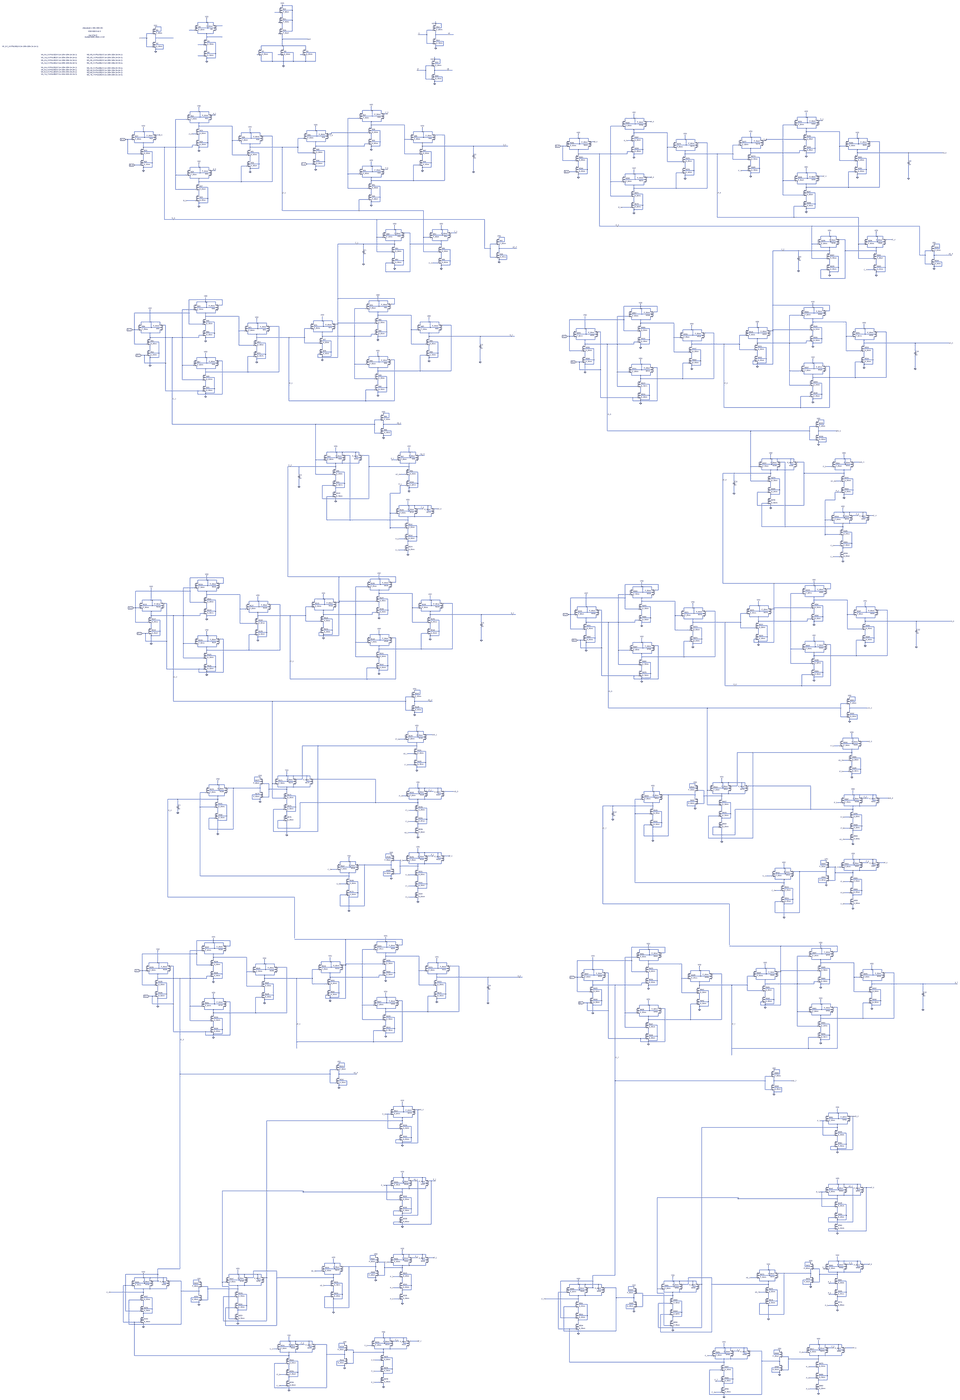
[diagram p0: schematic cla_transistor_level_schematic.asc, whole sheet]
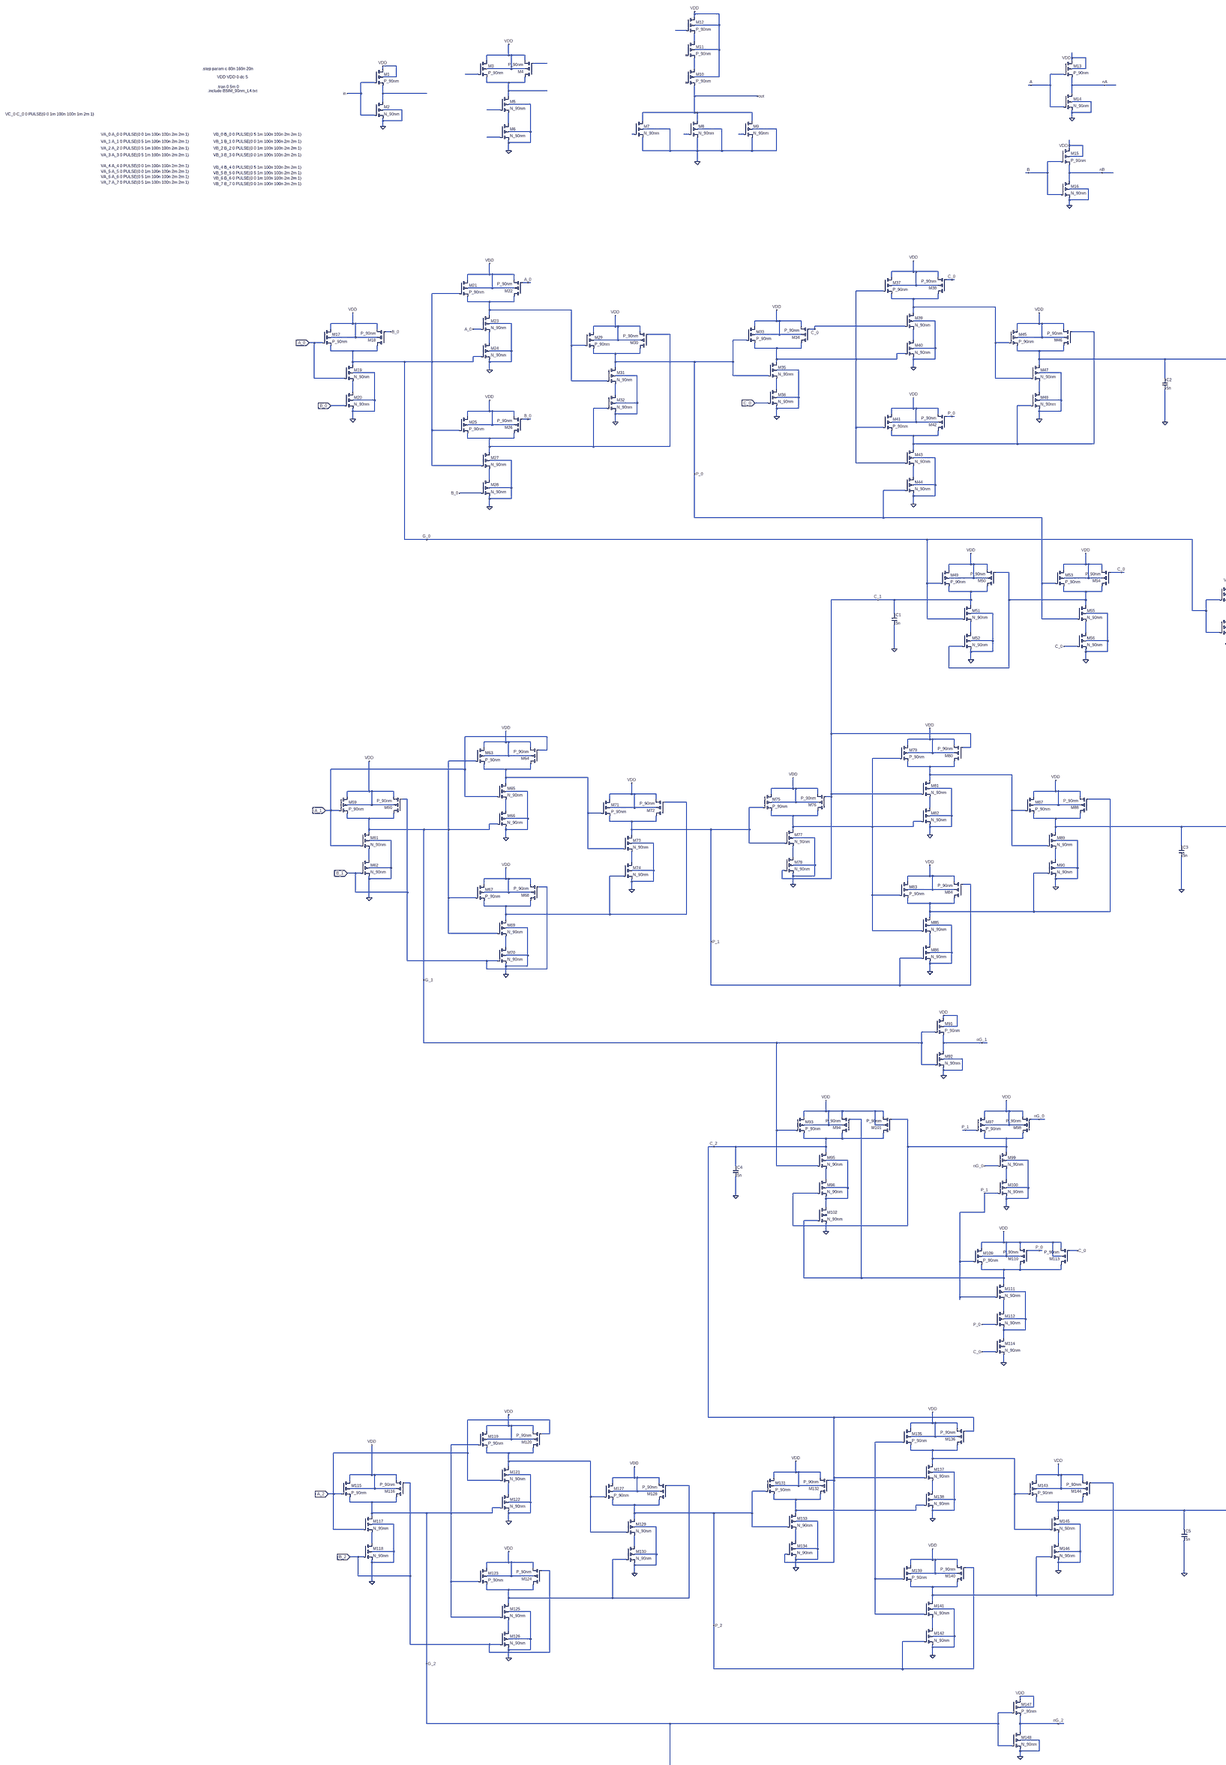
[diagram p1: schematic cla_transistor_level_schematic.asc, part, row 1 of 2, column 1 of 2]
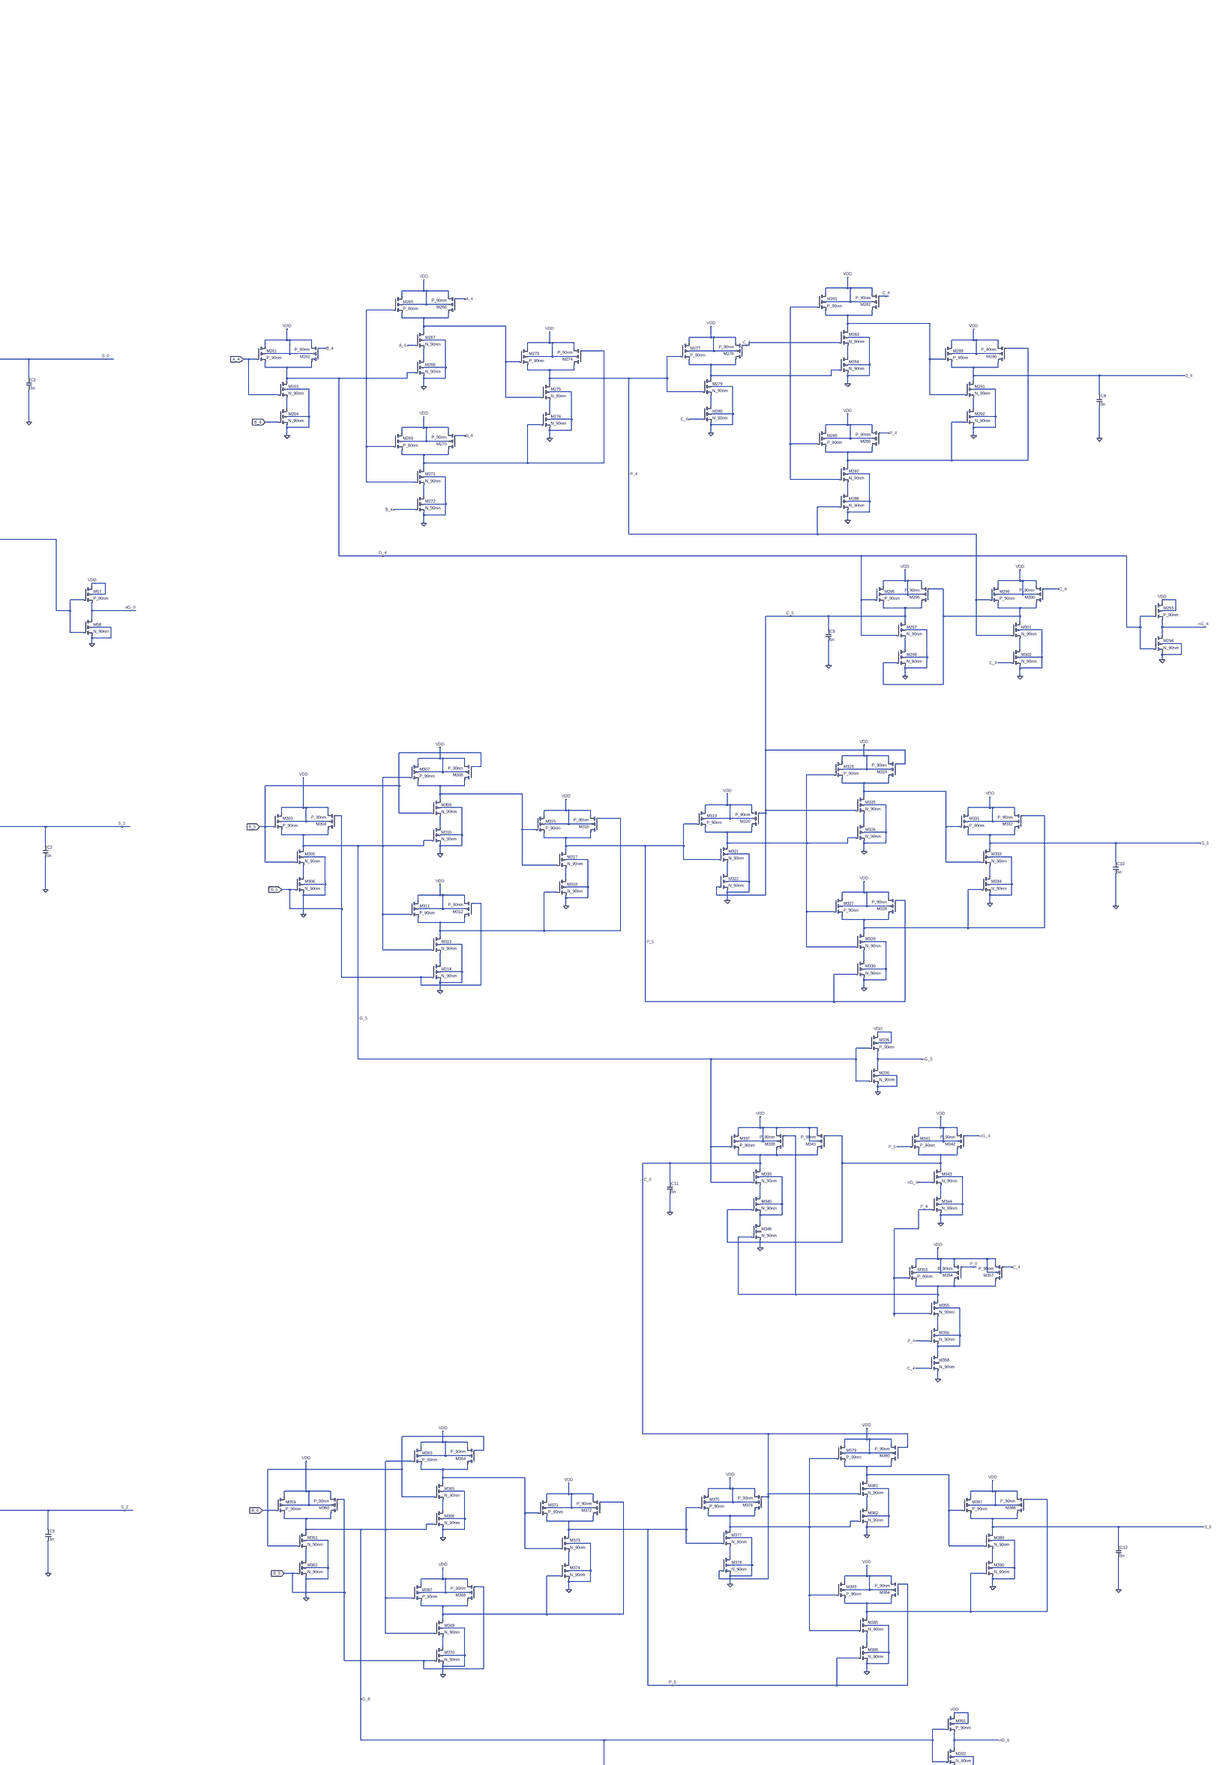
[diagram p2: schematic cla_transistor_level_schematic.asc, part, row 1 of 2, column 2 of 2]
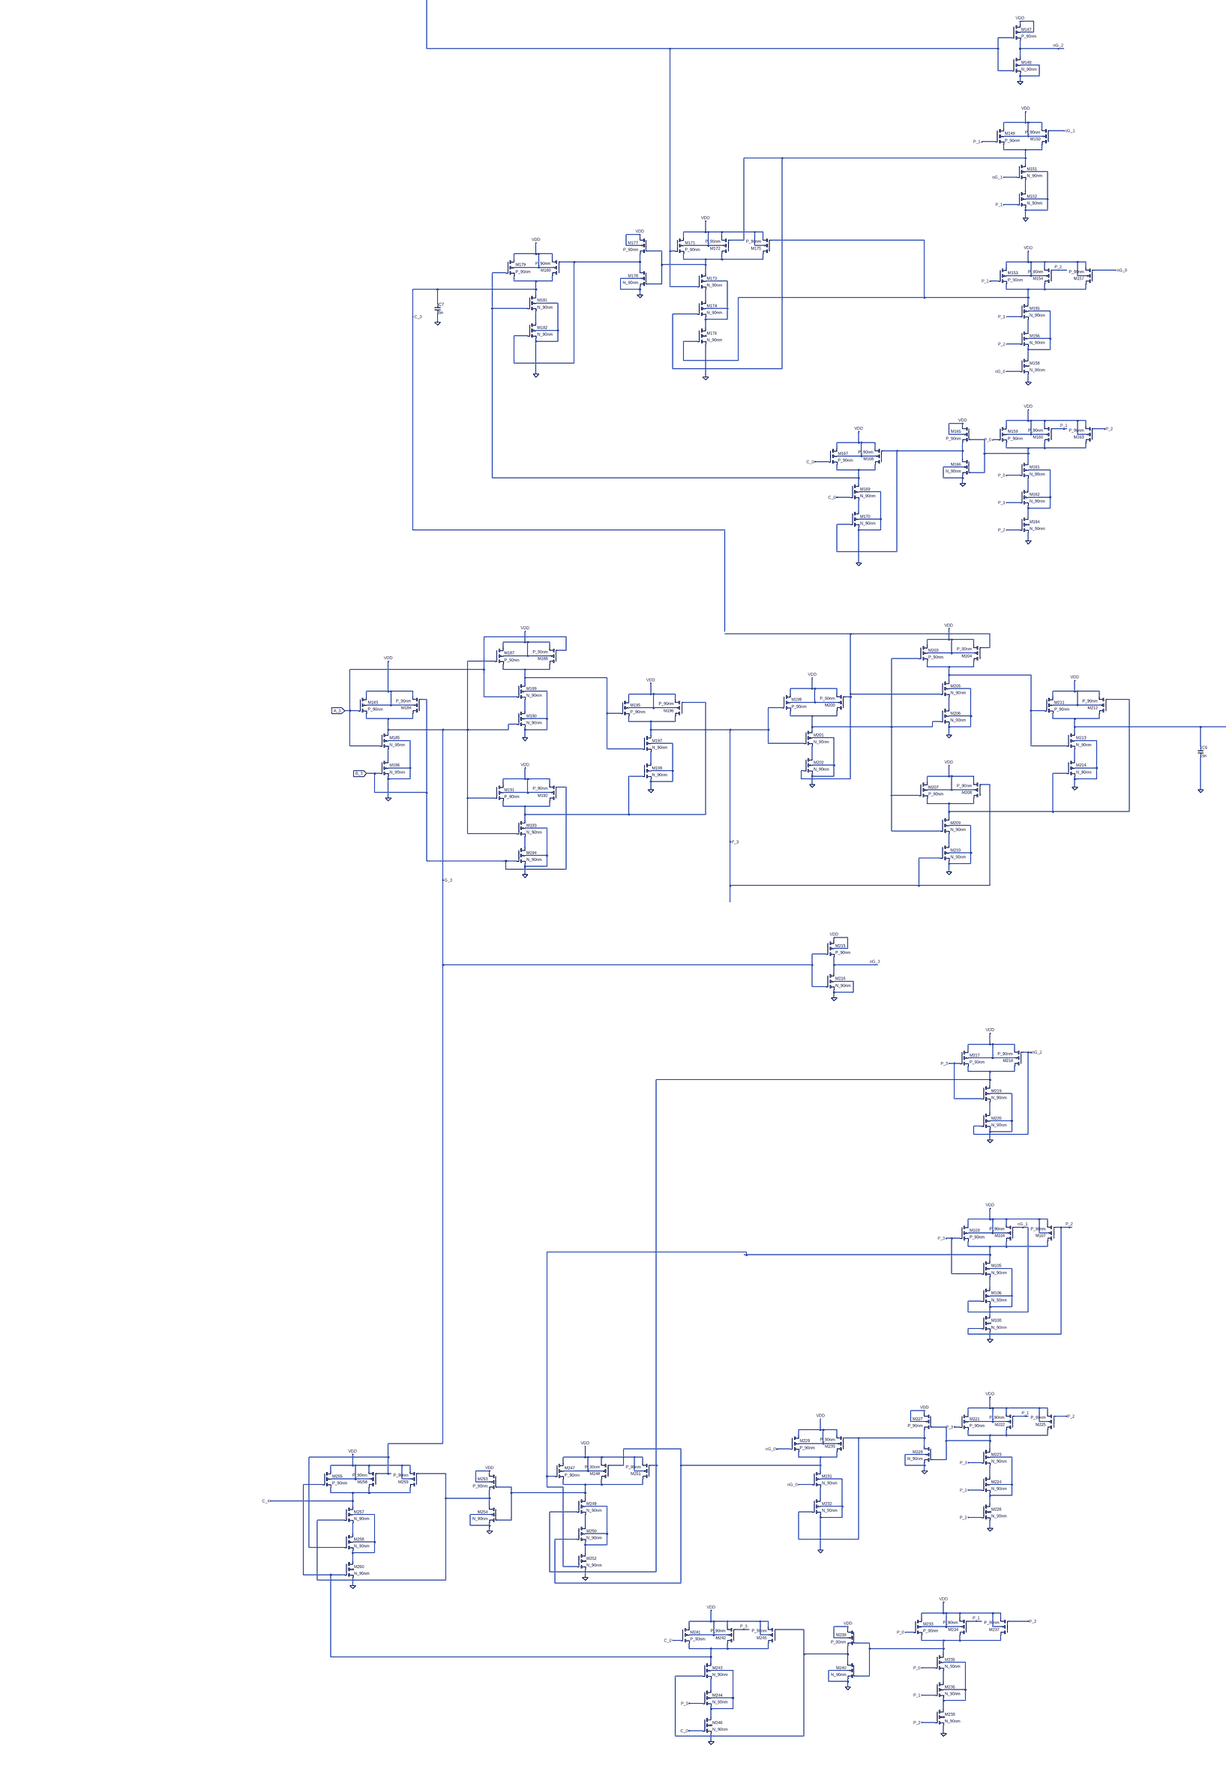
[diagram p3: schematic cla_transistor_level_schematic.asc, part, row 2 of 2, column 1 of 2]
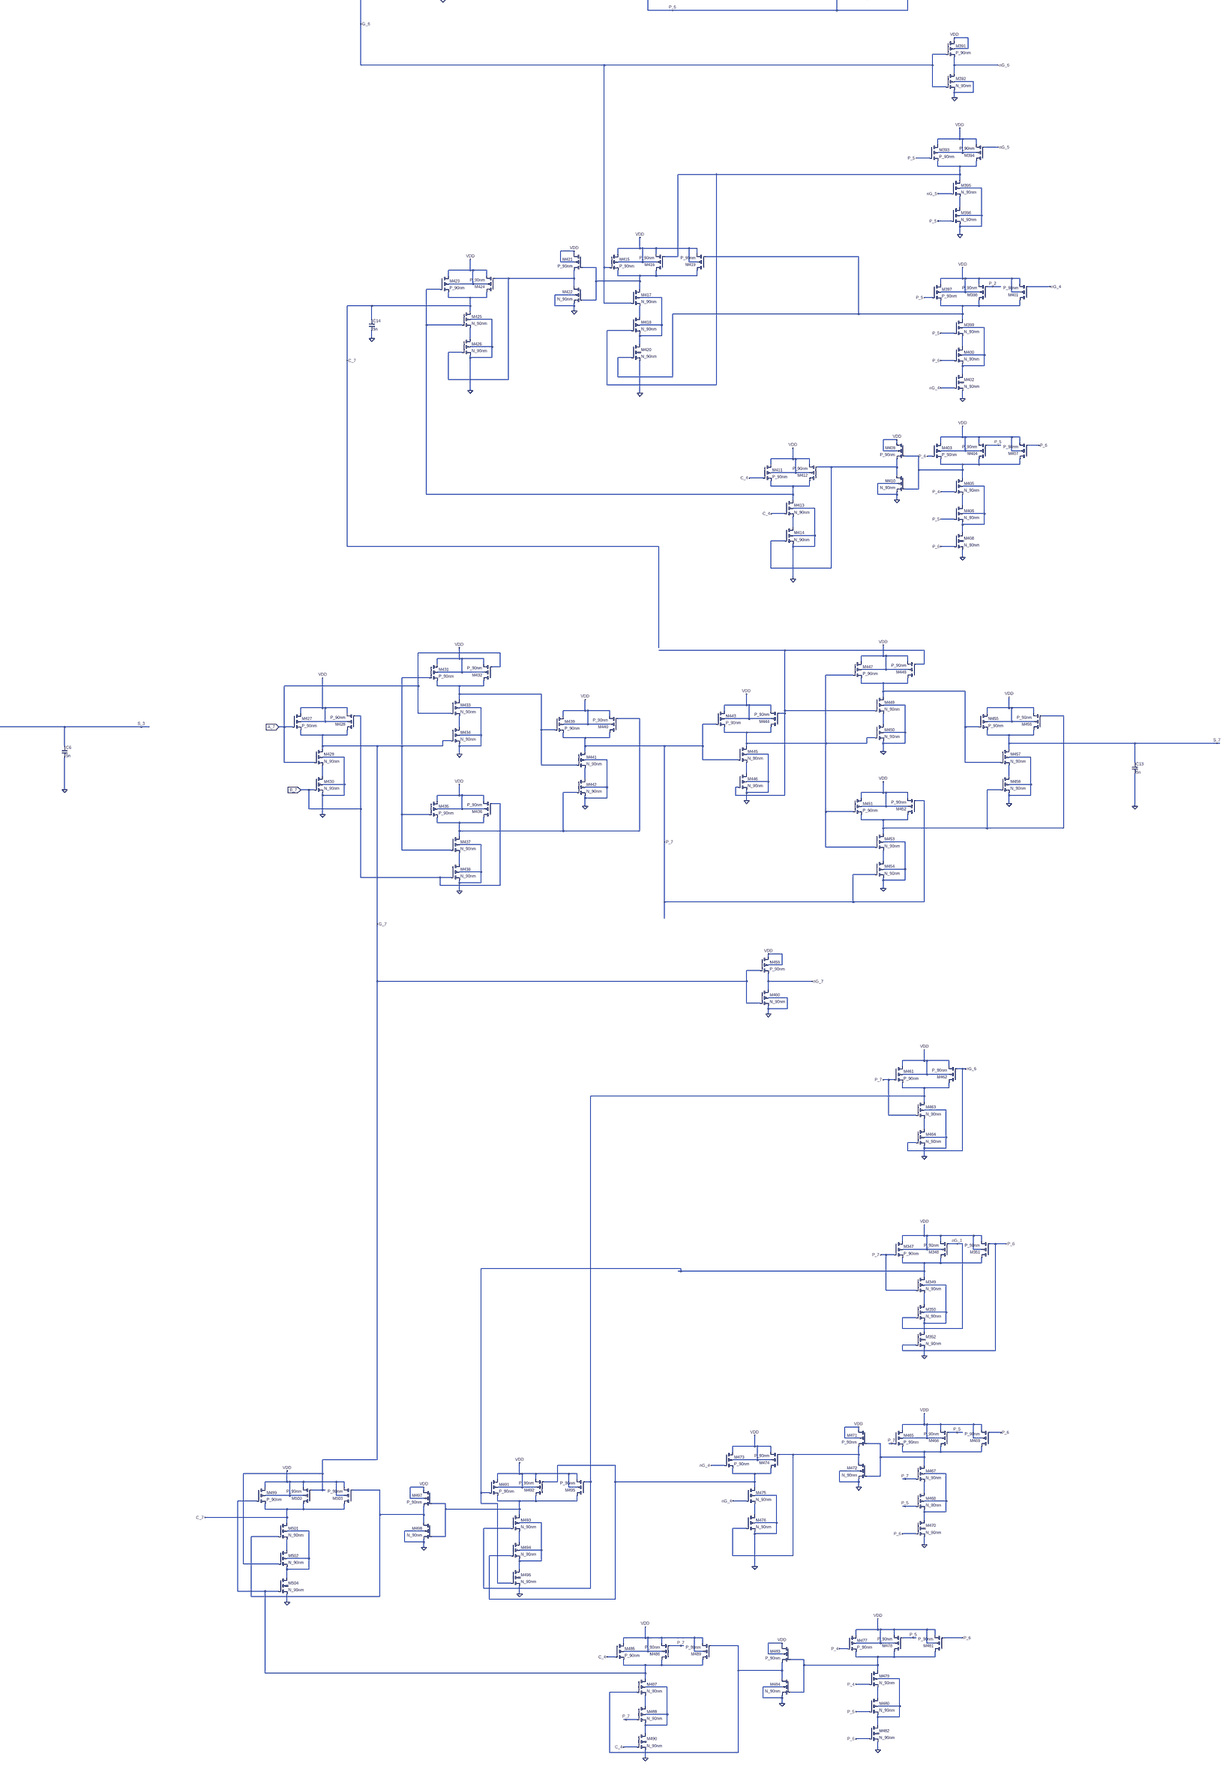
[diagram p4: schematic cla_transistor_level_schematic.asc, part, row 2 of 2, column 2 of 2]
* cla_transistor_level_schematic.asc
M1 VDD in N007 VDD P_90nm l=90n w=1800nm
M2 N007 in 0 0 N_90nm l=90n w=1800nm
M3 VDD N005 N006 VDD P_90nm l=90n w=1800n
M4 N006 N003 VDD VDD P_90nm l=90n w=1800n
M5 N006 N008 N009 0 N_90nm l=90n w=450n
M6 N009 N013 0 0 N_90nm l=90n w=450n
M7 out N010 0 0 N_90nm l=90n w=900n
M8 out N011 0 0 N_90nm l=90n w=900n
M9 out N012 0 0 N_90nm l=90n w=900n
M10 N004 NC_01 out VDD P_90nm l=90n w=600n
M11 N002 NC_02 N004 VDD P_90nm l=90n w=600n
M12 VDD N001 N002 VDD P_90nm l=90n w=600n
M13 VDD A nA VDD P_90nm l=90n w=1800nm
M14 nA A 0 0 N_90nm l=90n w=1800nm
M15 VDD B nB VDD P_90nm l=90n w=1800nm
M16 nB B 0 0 N_90nm l=90n w=1800nm
M17 VDD A_0 G_0 VDD P_90nm l=90n w=1800n
M18 G_0 B_0 VDD VDD P_90nm l=90n w=1800n
M19 G_0 A_0 N029 0 N_90nm l=90n w=450n
M20 N029 B_0 0 0 N_90nm l=90n w=450n
M21 VDD G_0 N016 VDD P_90nm l=90n w=1800n
M22 N016 A_0 VDD VDD P_90nm l=90n w=1800n
M23 N016 A_0 N023 0 N_90nm l=90n w=450n
M24 N023 G_0 0 0 N_90nm l=90n w=450n
M25 VDD G_0 N021 VDD P_90nm l=90n w=1800n
M26 N021 B_0 VDD VDD P_90nm l=90n w=1800n
M27 N021 G_0 N037 0 N_90nm l=90n w=450n
M28 N037 B_0 0 0 N_90nm l=90n w=450n
M29 VDD N016 P_0 VDD P_90nm l=90n w=1800n
M30 P_0 N021 VDD VDD P_90nm l=90n w=1800n
M31 P_0 N016 N031 0 N_90nm l=90n w=450n
M32 N031 N021 0 0 N_90nm l=90n w=450n
M33 VDD P_0 N014 VDD P_90nm l=90n w=1800n
M34 N014 C_0 VDD VDD P_90nm l=90n w=1800n
M35 N014 P_0 N028 0 N_90nm l=90n w=450n
M36 N028 C_0 0 0 N_90nm l=90n w=450n
M37 VDD N014 N015 VDD P_90nm l=90n w=1800n
M38 N015 C_0 VDD VDD P_90nm l=90n w=1800n
M39 N015 C_0 N022 0 N_90nm l=90n w=450n
M40 N022 N014 0 0 N_90nm l=90n w=450n
M41 VDD N014 N020 VDD P_90nm l=90n w=1800n
M42 N020 P_0 VDD VDD P_90nm l=90n w=1800n
M43 N020 N014 N036 0 N_90nm l=90n w=450n
M44 N036 P_0 0 0 N_90nm l=90n w=450n
M45 VDD N015 S_0 VDD P_90nm l=90n w=1800n
M46 S_0 N020 VDD VDD P_90nm l=90n w=1800n
M47 S_0 N015 N030 0 N_90nm l=90n w=450n
M48 N030 N020 0 0 N_90nm l=90n w=450n
C2 S_0 0 5n
M57 VDD G_0 nG_0 VDD P_90nm l=90n w=1800nm
M58 nG_0 G_0 0 0 N_90nm l=90n w=1800nm
M49 VDD G_0 C_1 VDD P_90nm l=90n w=1800n
M50 C_1 N040 VDD VDD P_90nm l=90n w=1800n
M51 C_1 G_0 N042 0 N_90nm l=90n w=450n
M52 N042 N040 0 0 N_90nm l=90n w=450n
M53 VDD P_0 N040 VDD P_90nm l=90n w=1800n
M54 N040 C_0 VDD VDD P_90nm l=90n w=1800n
M55 N040 P_0 N043 0 N_90nm l=90n w=450n
M56 N043 C_0 0 0 N_90nm l=90n w=450n
C1 C_1 0 5n
M59 VDD A_1 G_1 VDD P_90nm l=90n w=1800n
M60 G_1 B_1 VDD VDD P_90nm l=90n w=1800n
M61 G_1 A_1 N061 0 N_90nm l=90n w=450n
M62 N061 B_1 0 0 N_90nm l=90n w=450n
M63 VDD G_1 N048 VDD P_90nm l=90n w=1800n
M64 N048 A_1 VDD VDD P_90nm l=90n w=1800n
M65 N048 A_1 N055 0 N_90nm l=90n w=450n
M66 N055 G_1 0 0 N_90nm l=90n w=450n
M67 VDD G_1 N053 VDD P_90nm l=90n w=1800n
M68 N053 B_1 VDD VDD P_90nm l=90n w=1800n
M69 N053 G_1 N069 0 N_90nm l=90n w=450n
M70 N069 B_1 0 0 N_90nm l=90n w=450n
M71 VDD N048 P_1 VDD P_90nm l=90n w=1800n
M72 P_1 N053 VDD VDD P_90nm l=90n w=1800n
M73 P_1 N048 N063 0 N_90nm l=90n w=450n
M74 N063 N053 0 0 N_90nm l=90n w=450n
M75 VDD P_1 N046 VDD P_90nm l=90n w=1800n
M76 N046 C_1 VDD VDD P_90nm l=90n w=1800n
M77 N046 P_1 N060 0 N_90nm l=90n w=450n
M78 N060 C_1 0 0 N_90nm l=90n w=450n
M79 VDD N046 N047 VDD P_90nm l=90n w=1800n
M80 N047 C_1 VDD VDD P_90nm l=90n w=1800n
M81 N047 C_1 N054 0 N_90nm l=90n w=450n
M82 N054 N046 0 0 N_90nm l=90n w=450n
M83 VDD N046 N052 VDD P_90nm l=90n w=1800n
M84 N052 P_1 VDD VDD P_90nm l=90n w=1800n
M85 N052 N046 N068 0 N_90nm l=90n w=450n
M86 N068 P_1 0 0 N_90nm l=90n w=450n
M87 VDD N047 S_1 VDD P_90nm l=90n w=1800n
M88 S_1 N052 VDD VDD P_90nm l=90n w=1800n
M89 S_1 N047 N062 0 N_90nm l=90n w=450n
M90 N062 N052 0 0 N_90nm l=90n w=450n
C3 S_1 0 5n
M91 VDD G_1 nG_1 VDD P_90nm l=90n w=1800nm
M92 nG_1 G_1 0 0 N_90nm l=90n w=1800nm
M93 VDD G_1 C_2 VDD P_90nm l=90n w=1800n
M94 C_2 N072 VDD VDD P_90nm l=90n w=1800n
M95 C_2 G_1 N078 N076 N_90nm l=90n w=450n
M96 N078 N073 N076 N076 N_90nm l=90n w=450n
M97 VDD P_1 N073 VDD P_90nm l=90n w=1800n
M98 N073 nG_0 VDD VDD P_90nm l=90n w=1800n
M99 N073 nG_0 N079 0 N_90nm l=90n w=450n
M100 N079 P_1 0 0 N_90nm l=90n w=450n
M101 C_2 N073 VDD VDD P_90nm l=90n w=1800n
M102 N076 N072 0 NC_03 N_90nm l=90n w=450n
M103 VDD P_3 N176 VDD P_90nm l=90n w=1800n
M104 N176 nG_1 VDD VDD P_90nm l=90n w=1800n
M105 N176 P_3 N180 N178 N_90nm l=90n w=450n
M106 N180 nG_1 N178 N178 N_90nm l=90n w=450n
M107 N176 P_2 VDD VDD P_90nm l=90n w=1800n
M108 N178 P_2 0 NC_04 N_90nm l=90n w=450n
M109 VDD P_1 N072 VDD P_90nm l=90n w=1800n
M110 N072 P_0 VDD VDD P_90nm l=90n w=1800n
M111 N072 P_1 N084 N082 N_90nm l=90n w=450n
M112 N084 P_0 N082 N082 N_90nm l=90n w=450n
M113 N072 C_0 VDD VDD P_90nm l=90n w=1800n
M114 N082 C_0 0 NC_05 N_90nm l=90n w=450n
C4 C_2 0 5n
M115 VDD A_2 G_2 VDD P_90nm l=90n w=1800n
M116 G_2 B_2 VDD VDD P_90nm l=90n w=1800n
M117 G_2 A_2 N101 0 N_90nm l=90n w=450n
M118 N101 B_2 0 0 N_90nm l=90n w=450n
M119 VDD G_2 N088 VDD P_90nm l=90n w=1800n
M120 N088 A_2 VDD VDD P_90nm l=90n w=1800n
M121 N088 A_2 N095 0 N_90nm l=90n w=450n
M122 N095 G_2 0 0 N_90nm l=90n w=450n
M123 VDD G_2 N093 VDD P_90nm l=90n w=1800n
M124 N093 B_2 VDD VDD P_90nm l=90n w=1800n
M125 N093 G_2 N109 0 N_90nm l=90n w=450n
M126 N109 B_2 0 0 N_90nm l=90n w=450n
M127 VDD N088 P_2 VDD P_90nm l=90n w=1800n
M128 P_2 N093 VDD VDD P_90nm l=90n w=1800n
M129 P_2 N088 N103 0 N_90nm l=90n w=450n
M130 N103 N093 0 0 N_90nm l=90n w=450n
M131 VDD P_2 N086 VDD P_90nm l=90n w=1800n
M132 N086 C_2 VDD VDD P_90nm l=90n w=1800n
M133 N086 P_2 N100 0 N_90nm l=90n w=450n
M134 N100 C_2 0 0 N_90nm l=90n w=450n
M135 VDD N086 N087 VDD P_90nm l=90n w=1800n
M136 N087 C_2 VDD VDD P_90nm l=90n w=1800n
M137 N087 C_2 N094 0 N_90nm l=90n w=450n
M138 N094 N086 0 0 N_90nm l=90n w=450n
M139 VDD N086 N092 VDD P_90nm l=90n w=1800n
M140 N092 P_2 VDD VDD P_90nm l=90n w=1800n
M141 N092 N086 N108 0 N_90nm l=90n w=450n
M142 N108 P_2 0 0 N_90nm l=90n w=450n
M143 VDD N087 S_2 VDD P_90nm l=90n w=1800n
M144 S_2 N092 VDD VDD P_90nm l=90n w=1800n
M145 S_2 N087 N102 0 N_90nm l=90n w=450n
M146 N102 N092 0 0 N_90nm l=90n w=450n
C5 S_2 0 5n
M147 VDD G_2 nG_2 VDD P_90nm l=90n w=1800nm
M148 nG_2 G_2 0 0 N_90nm l=90n w=1800nm
M149 VDD P_1 N112 VDD P_90nm l=90n w=1800n
M150 N112 nG_1 VDD VDD P_90nm l=90n w=1800n
M151 N112 nG_1 N114 0 N_90nm l=90n w=450n
M152 N114 P_1 0 0 N_90nm l=90n w=450n
M153 VDD P_1 N116 VDD P_90nm l=90n w=1800n
M154 N116 P_2 VDD VDD P_90nm l=90n w=1800n
M155 N116 P_1 N131 N127 N_90nm l=90n w=450n
M156 N131 P_2 N127 N127 N_90nm l=90n w=450n
M157 N116 nG_0 VDD VDD P_90nm l=90n w=1800n
M158 N127 nG_0 0 NC_06 N_90nm l=90n w=450n
M159 VDD P_0 N134 VDD P_90nm l=90n w=1800n
M160 N134 P_1 VDD VDD P_90nm l=90n w=1800n
M161 N134 P_0 N140 N138 N_90nm l=90n w=450n
M162 N140 P_1 N138 N138 N_90nm l=90n w=450n
M163 N134 P_2 VDD VDD P_90nm l=90n w=1800n
M164 N138 P_2 0 NC_07 N_90nm l=90n w=450n
M165 VDD N134 N135 VDD P_90nm l=90n w=1800nm
M166 N135 N134 0 0 N_90nm l=90n w=1800nm
M167 VDD C_0 N121 VDD P_90nm l=90n w=1800n
M168 N121 N135 VDD VDD P_90nm l=90n w=1800n
M169 N121 C_0 N142 0 N_90nm l=90n w=450n
M170 N142 N135 0 0 N_90nm l=90n w=450n
M171 VDD G_2 N117 VDD P_90nm l=90n w=1800n
M172 N117 N112 VDD VDD P_90nm l=90n w=1800n
M173 N117 G_2 N126 N123 N_90nm l=90n w=450n
M174 N126 N112 N123 N123 N_90nm l=90n w=450n
M175 N117 N116 VDD VDD P_90nm l=90n w=1800n
M176 N123 N116 0 NC_08 N_90nm l=90n w=450n
M177 VDD N117 N119 VDD P_90nm l=90n w=1800nm
M178 N119 N117 0 0 N_90nm l=90n w=1800nm
M179 VDD N121 C_3 VDD P_90nm l=90n w=1800n
M180 C_3 N119 VDD VDD P_90nm l=90n w=1800n
M181 C_3 N121 N129 0 N_90nm l=90n w=450n
M182 N129 N119 0 0 N_90nm l=90n w=450n
M183 VDD A_3 G_3 VDD P_90nm l=90n w=1800n
M184 G_3 B_3 VDD VDD P_90nm l=90n w=1800n
M185 G_3 A_3 N161 0 N_90nm l=90n w=450n
M186 N161 B_3 0 0 N_90nm l=90n w=450n
M187 VDD G_3 N148 VDD P_90nm l=90n w=1800n
M188 N148 A_3 VDD VDD P_90nm l=90n w=1800n
M189 N148 A_3 N155 0 N_90nm l=90n w=450n
M190 N155 G_3 0 0 N_90nm l=90n w=450n
M191 VDD G_3 N153 VDD P_90nm l=90n w=1800n
M192 N153 B_3 VDD VDD P_90nm l=90n w=1800n
M193 N153 G_3 N169 0 N_90nm l=90n w=450n
M194 N169 B_3 0 0 N_90nm l=90n w=450n
M195 VDD N148 P_3 VDD P_90nm l=90n w=1800n
M196 P_3 N153 VDD VDD P_90nm l=90n w=1800n
M197 P_3 N148 N163 0 N_90nm l=90n w=450n
M198 N163 N153 0 0 N_90nm l=90n w=450n
M199 VDD P_3 N146 VDD P_90nm l=90n w=1800n
M200 N146 N144 VDD VDD P_90nm l=90n w=1800n
M201 N146 P_3 N160 0 N_90nm l=90n w=450n
M202 N160 N144 0 0 N_90nm l=90n w=450n
M203 VDD N146 N147 VDD P_90nm l=90n w=1800n
M204 N147 N144 VDD VDD P_90nm l=90n w=1800n
M205 N147 N144 N154 0 N_90nm l=90n w=450n
M206 N154 N146 0 0 N_90nm l=90n w=450n
M207 VDD N146 N152 VDD P_90nm l=90n w=1800n
M208 N152 P_3 VDD VDD P_90nm l=90n w=1800n
M209 N152 N146 N168 0 N_90nm l=90n w=450n
M210 N168 P_3 0 0 N_90nm l=90n w=450n
M211 VDD N147 S_3 VDD P_90nm l=90n w=1800n
M212 S_3 N152 VDD VDD P_90nm l=90n w=1800n
M213 S_3 N147 N162 0 N_90nm l=90n w=450n
M214 N162 N152 0 0 N_90nm l=90n w=450n
C6 S_3 0 5n
C7 C_3 0 5n
M215 VDD G_3 nG_3 VDD P_90nm l=90n w=1800nm
M216 nG_3 G_3 0 0 N_90nm l=90n w=1800nm
M217 VDD P_3 N172 VDD P_90nm l=90n w=1800n
M218 N172 nG_2 VDD VDD P_90nm l=90n w=1800n
M219 N172 P_3 N174 0 N_90nm l=90n w=450n
M220 N174 nG_2 0 0 N_90nm l=90n w=450n
M221 VDD P_3 N182 VDD P_90nm l=90n w=1800n
M222 N182 P_1 VDD VDD P_90nm l=90n w=1800n
M223 N182 P_3 N191 N187 N_90nm l=90n w=450n
M224 N191 P_1 N187 N187 N_90nm l=90n w=450n
M225 N182 P_2 VDD VDD P_90nm l=90n w=1800n
M226 N187 P_2 0 NC_09 N_90nm l=90n w=450n
M227 VDD N182 N183 VDD P_90nm l=90n w=1800nm
M228 N183 N182 0 0 N_90nm l=90n w=1800nm
M229 VDD nG_0 N185 VDD P_90nm l=90n w=1800n
M230 N185 N183 VDD VDD P_90nm l=90n w=1800n
M231 N185 nG_0 N196 0 N_90nm l=90n w=450n
M232 N196 N183 0 0 N_90nm l=90n w=450n
M233 VDD P_0 N209 VDD P_90nm l=90n w=1800n
M234 N209 P_1 VDD VDD P_90nm l=90n w=1800n
M235 N209 P_0 N215 N212 N_90nm l=90n w=450n
M236 N215 P_1 N212 N212 N_90nm l=90n w=450n
M237 N209 P_2 VDD VDD P_90nm l=90n w=1800n
M238 N212 P_2 0 NC_10 N_90nm l=90n w=450n
M239 VDD N209 N208 VDD P_90nm l=90n w=1800nm
M240 N208 N209 0 0 N_90nm l=90n w=1800nm
M241 VDD C_0 N192 VDD P_90nm l=90n w=1800n
M242 N192 P_3 VDD VDD P_90nm l=90n w=1800n
M243 N192 N208 N217 N213 N_90nm l=90n w=450n
M244 N217 P_3 N213 N213 N_90nm l=90n w=450n
M245 N192 N208 VDD VDD P_90nm l=90n w=1800n
M246 N213 C_0 0 NC_11 N_90nm l=90n w=450n
M247 VDD N176 N193 VDD P_90nm l=90n w=1800n
M248 N193 N185 VDD VDD P_90nm l=90n w=1800n
M249 N193 N172 N203 N199 N_90nm l=90n w=450n
M250 N203 N185 N199 N199 N_90nm l=90n w=450n
M251 N193 N172 VDD VDD P_90nm l=90n w=1800n
M252 N199 N176 0 NC_12 N_90nm l=90n w=450n
M253 VDD N193 N189 VDD P_90nm l=90n w=1800nm
M254 N189 N193 0 0 N_90nm l=90n w=1800nm
M255 VDD N192 C_4 VDD P_90nm l=90n w=1800n
M256 C_4 G_3 VDD VDD P_90nm l=90n w=1800n
M257 C_4 N189 N205 N200 N_90nm l=90n w=450n
M258 N205 G_3 N200 N200 N_90nm l=90n w=450n
M259 C_4 N189 VDD VDD P_90nm l=90n w=1800n
M260 N200 N192 0 NC_13 N_90nm l=90n w=450n
M261 VDD A_4 G_4 VDD P_90nm l=90n w=1800n
M262 G_4 B_4 VDD VDD P_90nm l=90n w=1800n
M263 G_4 A_4 N033 0 N_90nm l=90n w=450n
M264 N033 B_4 0 0 N_90nm l=90n w=450n
M265 VDD G_4 N019 VDD P_90nm l=90n w=1800n
M266 N019 A_4 VDD VDD P_90nm l=90n w=1800n
M267 N019 A_4 N027 0 N_90nm l=90n w=450n
M268 N027 G_4 0 0 N_90nm l=90n w=450n
M269 VDD G_4 N025 VDD P_90nm l=90n w=1800n
M270 N025 B_4 VDD VDD P_90nm l=90n w=1800n
M271 N025 G_4 N039 0 N_90nm l=90n w=450n
M272 N039 B_4 0 0 N_90nm l=90n w=450n
M273 VDD N019 P_4 VDD P_90nm l=90n w=1800n
M274 P_4 N025 VDD VDD P_90nm l=90n w=1800n
M275 P_4 N019 N035 0 N_90nm l=90n w=450n
M276 N035 N025 0 0 N_90nm l=90n w=450n
M277 VDD P_4 N017 VDD P_90nm l=90n w=1800n
M278 N017 C_4 VDD VDD P_90nm l=90n w=1800n
M279 N017 P_4 N032 0 N_90nm l=90n w=450n
M280 N032 C_4 0 0 N_90nm l=90n w=450n
M281 VDD N017 N018 VDD P_90nm l=90n w=1800n
M282 N018 C_4 VDD VDD P_90nm l=90n w=1800n
M283 N018 C_4 N026 0 N_90nm l=90n w=450n
M284 N026 N017 0 0 N_90nm l=90n w=450n
M285 VDD N017 N024 VDD P_90nm l=90n w=1800n
M286 N024 P_4 VDD VDD P_90nm l=90n w=1800n
M287 N024 N017 N038 0 N_90nm l=90n w=450n
M288 N038 P_4 0 0 N_90nm l=90n w=450n
M289 VDD N018 S_4 VDD P_90nm l=90n w=1800n
M290 S_4 N024 VDD VDD P_90nm l=90n w=1800n
M291 S_4 N018 N034 0 N_90nm l=90n w=450n
M292 N034 N024 0 0 N_90nm l=90n w=450n
C8 S_4 0 5n
M293 VDD G_4 nG_4 VDD P_90nm l=90n w=1800nm
M294 nG_4 G_4 0 0 N_90nm l=90n w=1800nm
M295 VDD G_4 C_5 VDD P_90nm l=90n w=1800n
M296 C_5 N041 VDD VDD P_90nm l=90n w=1800n
M297 C_5 G_4 N044 0 N_90nm l=90n w=450n
M298 N044 N041 0 0 N_90nm l=90n w=450n
M299 VDD P_4 N041 VDD P_90nm l=90n w=1800n
M300 N041 C_4 VDD VDD P_90nm l=90n w=1800n
M301 N041 P_4 N045 0 N_90nm l=90n w=450n
M302 N045 C_4 0 0 N_90nm l=90n w=450n
C9 C_5 0 5n
M303 VDD A_5 G_5 VDD P_90nm l=90n w=1800n
M304 G_5 B_5 VDD VDD P_90nm l=90n w=1800n
M305 G_5 A_5 N065 0 N_90nm l=90n w=450n
M306 N065 B_5 0 0 N_90nm l=90n w=450n
M307 VDD G_5 N051 VDD P_90nm l=90n w=1800n
M308 N051 A_5 VDD VDD P_90nm l=90n w=1800n
M309 N051 A_5 N059 0 N_90nm l=90n w=450n
M310 N059 G_5 0 0 N_90nm l=90n w=450n
M311 VDD G_5 N057 VDD P_90nm l=90n w=1800n
M312 N057 B_5 VDD VDD P_90nm l=90n w=1800n
M313 N057 G_5 N071 0 N_90nm l=90n w=450n
M314 N071 B_5 0 0 N_90nm l=90n w=450n
M315 VDD N051 P_5 VDD P_90nm l=90n w=1800n
M316 P_5 N057 VDD VDD P_90nm l=90n w=1800n
M317 P_5 N051 N067 0 N_90nm l=90n w=450n
M318 N067 N057 0 0 N_90nm l=90n w=450n
M319 VDD P_5 N049 VDD P_90nm l=90n w=1800n
M320 N049 C_5 VDD VDD P_90nm l=90n w=1800n
M321 N049 P_5 N064 0 N_90nm l=90n w=450n
M322 N064 C_5 0 0 N_90nm l=90n w=450n
M323 VDD N049 N050 VDD P_90nm l=90n w=1800n
M324 N050 C_5 VDD VDD P_90nm l=90n w=1800n
M325 N050 C_5 N058 0 N_90nm l=90n w=450n
M326 N058 N049 0 0 N_90nm l=90n w=450n
M327 VDD N049 N056 VDD P_90nm l=90n w=1800n
M328 N056 P_5 VDD VDD P_90nm l=90n w=1800n
M329 N056 N049 N070 0 N_90nm l=90n w=450n
M330 N070 P_5 0 0 N_90nm l=90n w=450n
M331 VDD N050 S_5 VDD P_90nm l=90n w=1800n
M332 S_5 N056 VDD VDD P_90nm l=90n w=1800n
M333 S_5 N050 N066 0 N_90nm l=90n w=450n
M334 N066 N056 0 0 N_90nm l=90n w=450n
C10 S_5 0 5n
M335 VDD G_5 nG_5 VDD P_90nm l=90n w=1800nm
M336 nG_5 G_5 0 0 N_90nm l=90n w=1800nm
M337 VDD G_5 C_6 VDD P_90nm l=90n w=1800n
M338 C_6 N074 VDD VDD P_90nm l=90n w=1800n
M339 C_6 G_5 N080 N077 N_90nm l=90n w=450n
M340 N080 N075 N077 N077 N_90nm l=90n w=450n
M341 VDD P_5 N075 VDD P_90nm l=90n w=1800n
M342 N075 nG_4 VDD VDD P_90nm l=90n w=1800n
M343 N075 nG_4 N081 0 N_90nm l=90n w=450n
M344 N081 P_4 0 0 N_90nm l=90n w=450n
M345 C_6 N075 VDD VDD P_90nm l=90n w=1800n
M346 N077 N074 0 NC_14 N_90nm l=90n w=450n
M347 VDD P_7 N177 VDD P_90nm l=90n w=1800n
M348 N177 nG_1 VDD VDD P_90nm l=90n w=1800n
M349 N177 P_7 N181 N179 N_90nm l=90n w=450n
M350 N181 nG_1 N179 N179 N_90nm l=90n w=450n
M351 N177 P_6 VDD VDD P_90nm l=90n w=1800n
M352 N179 P_6 0 NC_15 N_90nm l=90n w=450n
M353 VDD P_4 N074 VDD P_90nm l=90n w=1800n
M354 N074 P_0 VDD VDD P_90nm l=90n w=1800n
M355 N074 P_4 N085 N083 N_90nm l=90n w=450n
M356 N085 P_4 N083 N083 N_90nm l=90n w=450n
M357 N074 C_4 VDD VDD P_90nm l=90n w=1800n
M358 N083 C_4 0 NC_16 N_90nm l=90n w=450n
C11 C_6 0 5n
M359 VDD A_6 G_6 VDD P_90nm l=90n w=1800n
M360 G_6 B_6 VDD VDD P_90nm l=90n w=1800n
M361 G_6 A_6 N105 0 N_90nm l=90n w=450n
M362 N105 B_6 0 0 N_90nm l=90n w=450n
M363 VDD G_6 N091 VDD P_90nm l=90n w=1800n
M364 N091 A_6 VDD VDD P_90nm l=90n w=1800n
M365 N091 A_6 N099 0 N_90nm l=90n w=450n
M366 N099 G_6 0 0 N_90nm l=90n w=450n
M367 VDD G_6 N097 VDD P_90nm l=90n w=1800n
M368 N097 B_6 VDD VDD P_90nm l=90n w=1800n
M369 N097 G_6 N111 0 N_90nm l=90n w=450n
M370 N111 B_6 0 0 N_90nm l=90n w=450n
M371 VDD N091 P_6 VDD P_90nm l=90n w=1800n
M372 P_6 N097 VDD VDD P_90nm l=90n w=1800n
M373 P_6 N091 N107 0 N_90nm l=90n w=450n
M374 N107 N097 0 0 N_90nm l=90n w=450n
M375 VDD P_6 N089 VDD P_90nm l=90n w=1800n
M376 N089 C_6 VDD VDD P_90nm l=90n w=1800n
M377 N089 P_6 N104 0 N_90nm l=90n w=450n
M378 N104 C_6 0 0 N_90nm l=90n w=450n
M379 VDD N089 N090 VDD P_90nm l=90n w=1800n
M380 N090 C_6 VDD VDD P_90nm l=90n w=1800n
M381 N090 C_6 N098 0 N_90nm l=90n w=450n
M382 N098 N089 0 0 N_90nm l=90n w=450n
M383 VDD N089 N096 VDD P_90nm l=90n w=1800n
M384 N096 P_6 VDD VDD P_90nm l=90n w=1800n
M385 N096 N089 N110 0 N_90nm l=90n w=450n
M386 N110 P_6 0 0 N_90nm l=90n w=450n
M387 VDD N090 S_6 VDD P_90nm l=90n w=1800n
M388 S_6 N096 VDD VDD P_90nm l=90n w=1800n
M389 S_6 N090 N106 0 N_90nm l=90n w=450n
M390 N106 N096 0 0 N_90nm l=90n w=450n
C12 S_6 0 5n
M391 VDD G_6 nG_6 VDD P_90nm l=90n w=1800nm
M392 nG_6 G_6 0 0 N_90nm l=90n w=1800nm
M393 VDD P_5 N113 VDD P_90nm l=90n w=1800n
M394 N113 nG_5 VDD VDD P_90nm l=90n w=1800n
M395 N113 nG_5 N115 0 N_90nm l=90n w=450n
M396 N115 P_5 0 0 N_90nm l=90n w=450n
M397 VDD P_5 N118 VDD P_90nm l=90n w=1800n
M398 N118 P_2 VDD VDD P_90nm l=90n w=1800n
M399 N118 P_5 N133 N130 N_90nm l=90n w=450n
M400 N133 P_6 N130 N130 N_90nm l=90n w=450n
M401 N118 nG_4 VDD VDD P_90nm l=90n w=1800n
M402 N130 nG_4 0 NC_17 N_90nm l=90n w=450n
M403 VDD P_4 N136 VDD P_90nm l=90n w=1800n
M404 N136 P_5 VDD VDD P_90nm l=90n w=1800n
M405 N136 P_4 N141 N139 N_90nm l=90n w=450n
M406 N141 P_5 N139 N139 N_90nm l=90n w=450n
M407 N136 P_6 VDD VDD P_90nm l=90n w=1800n
M408 N139 P_6 0 NC_18 N_90nm l=90n w=450n
M409 VDD N136 N137 VDD P_90nm l=90n w=1800nm
M410 N137 N136 0 0 N_90nm l=90n w=1800nm
M411 VDD C_4 N124 VDD P_90nm l=90n w=1800n
M412 N124 N137 VDD VDD P_90nm l=90n w=1800n
M413 N124 C_4 N143 0 N_90nm l=90n w=450n
M414 N143 N137 0 0 N_90nm l=90n w=450n
M415 VDD G_6 N120 VDD P_90nm l=90n w=1800n
M416 N120 N113 VDD VDD P_90nm l=90n w=1800n
M417 N120 G_6 N128 N125 N_90nm l=90n w=450n
M418 N128 N113 N125 N125 N_90nm l=90n w=450n
M419 N120 N118 VDD VDD P_90nm l=90n w=1800n
M420 N125 N118 0 NC_19 N_90nm l=90n w=450n
M421 VDD N120 N122 VDD P_90nm l=90n w=1800nm
M422 N122 N120 0 0 N_90nm l=90n w=1800nm
M423 VDD N124 C_7 VDD P_90nm l=90n w=1800n
M424 C_7 N122 VDD VDD P_90nm l=90n w=1800n
M425 C_7 N124 N132 0 N_90nm l=90n w=450n
M426 N132 N122 0 0 N_90nm l=90n w=450n
M427 VDD A_7 G_7 VDD P_90nm l=90n w=1800n
M428 G_7 B_7 VDD VDD P_90nm l=90n w=1800n
M429 G_7 A_7 N165 0 N_90nm l=90n w=450n
M430 N165 B_7 0 0 N_90nm l=90n w=450n
M431 VDD G_7 N151 VDD P_90nm l=90n w=1800n
M432 N151 A_7 VDD VDD P_90nm l=90n w=1800n
M433 N151 A_7 N159 0 N_90nm l=90n w=450n
M434 N159 G_7 0 0 N_90nm l=90n w=450n
M435 VDD G_7 N157 VDD P_90nm l=90n w=1800n
M436 N157 B_7 VDD VDD P_90nm l=90n w=1800n
M437 N157 G_7 N171 0 N_90nm l=90n w=450n
M438 N171 B_7 0 0 N_90nm l=90n w=450n
M439 VDD N151 P_7 VDD P_90nm l=90n w=1800n
M440 P_7 N157 VDD VDD P_90nm l=90n w=1800n
M441 P_7 N151 N167 0 N_90nm l=90n w=450n
M442 N167 N157 0 0 N_90nm l=90n w=450n
M443 VDD P_7 N149 VDD P_90nm l=90n w=1800n
M444 N149 N145 VDD VDD P_90nm l=90n w=1800n
M445 N149 P_7 N164 0 N_90nm l=90n w=450n
M446 N164 N145 0 0 N_90nm l=90n w=450n
M447 VDD N149 N150 VDD P_90nm l=90n w=1800n
M448 N150 N145 VDD VDD P_90nm l=90n w=1800n
M449 N150 N145 N158 0 N_90nm l=90n w=450n
M450 N158 N149 0 0 N_90nm l=90n w=450n
M451 VDD N149 N156 VDD P_90nm l=90n w=1800n
M452 N156 P_7 VDD VDD P_90nm l=90n w=1800n
M453 N156 N149 N170 0 N_90nm l=90n w=450n
M454 N170 P_7 0 0 N_90nm l=90n w=450n
M455 VDD N150 S_7 VDD P_90nm l=90n w=1800n
M456 S_7 N156 VDD VDD P_90nm l=90n w=1800n
M457 S_7 N150 N166 0 N_90nm l=90n w=450n
M458 N166 N156 0 0 N_90nm l=90n w=450n
C13 S_7 0 5n
C14 C_7 0 5n
M459 VDD G_7 nG_7 VDD P_90nm l=90n w=1800nm
M460 nG_7 G_7 0 0 N_90nm l=90n w=1800nm
M461 VDD P_7 N173 VDD P_90nm l=90n w=1800n
M462 N173 nG_6 VDD VDD P_90nm l=90n w=1800n
M463 N173 P_7 N175 0 N_90nm l=90n w=450n
M464 N175 nG_6 0 0 N_90nm l=90n w=450n
M465 VDD P_7 N184 VDD P_90nm l=90n w=1800n
M466 N184 P_5 VDD VDD P_90nm l=90n w=1800n
M467 N184 P_7 N195 N190 N_90nm l=90n w=450n
M468 N195 P_5 N190 N190 N_90nm l=90n w=450n
M469 N184 P_6 VDD VDD P_90nm l=90n w=1800n
M470 N190 P_6 0 NC_20 N_90nm l=90n w=450n
M471 VDD N184 N186 VDD P_90nm l=90n w=1800nm
M472 N186 N184 0 0 N_90nm l=90n w=1800nm
M473 VDD nG_4 N188 VDD P_90nm l=90n w=1800n
M474 N188 N186 VDD VDD P_90nm l=90n w=1800n
M475 N188 nG_4 N201 0 N_90nm l=90n w=450n
M476 N201 N186 0 0 N_90nm l=90n w=450n
M477 VDD P_4 N211 VDD P_90nm l=90n w=1800n
M478 N211 P_5 VDD VDD P_90nm l=90n w=1800n
M479 N211 P_4 N218 N214 N_90nm l=90n w=450n
M480 N218 P_5 N214 N214 N_90nm l=90n w=450n
M481 N211 P_6 VDD VDD P_90nm l=90n w=1800n
M482 N214 P_6 0 NC_21 N_90nm l=90n w=450n
M483 VDD N211 N210 VDD P_90nm l=90n w=1800nm
M484 N210 N211 0 0 N_90nm l=90n w=1800nm
M485 VDD C_4 N197 VDD P_90nm l=90n w=1800n
M486 N197 P_7 VDD VDD P_90nm l=90n w=1800n
M487 N197 N210 N219 N216 N_90nm l=90n w=450n
M488 N219 P_7 N216 N216 N_90nm l=90n w=450n
M489 N197 N210 VDD VDD P_90nm l=90n w=1800n
M490 N216 C_4 0 NC_22 N_90nm l=90n w=450n
M491 VDD N177 N198 VDD P_90nm l=90n w=1800n
M492 N198 N188 VDD VDD P_90nm l=90n w=1800n
M493 N198 N173 N206 N202 N_90nm l=90n w=450n
M494 N206 N188 N202 N202 N_90nm l=90n w=450n
M495 N198 N173 VDD VDD P_90nm l=90n w=1800n
M496 N202 N177 0 NC_23 N_90nm l=90n w=450n
M497 VDD N198 N194 VDD P_90nm l=90n w=1800nm
M498 N194 N198 0 0 N_90nm l=90n w=1800nm
M499 VDD N197 C_7 VDD P_90nm l=90n w=1800n
M500 C_7 G_7 VDD VDD P_90nm l=90n w=1800n
M501 C_7 N194 N207 N204 N_90nm l=90n w=450n
M502 N207 G_7 N204 N204 N_90nm l=90n w=450n
M503 C_7 N194 VDD VDD P_90nm l=90n w=1800n
M504 N204 N197 0 NC_24 N_90nm l=90n w=450n
.model NMOS NMOS
.model PMOS PMOS
.lib standard.mos
VDD VDD 0 dc 5
.tran 0 5m 0
.include BSIM_90nm_L4.txt
VA_0 A_0 0 PULSE(0 0 1m 100n 100n 2m 2m 1)
VB_0 B_0 0 PULSE(0 5 1m 100n 100n 2m 2m 1)
.step param c 80n 160n 20n
VC_0 C_0 0 PULSE(0 0 1m 100n 100n 1m 2m 1)
VA_1 A_1 0 PULSE(0 5 1m 100n 100n 2m 2m 1)
VB_1 B_1 0 PULSE(0 0 1m 100n 100n 2m 2m 1)
VA_2 A_2 0 PULSE(0 5 1m 100n 100n 2m 2m 1)
VB_2 B_2 0 PULSE(0 0 1m 100n 100n 2m 2m 1)
VA_3 A_3 0 PULSE(0 5 1m 100n 100n 2m 2m 1)
VB_3 B_3 0 PULSE(0 0 1m 100n 100n 2m 2m 1)
VA_4 A_4 0 PULSE(0 0 1m 100n 100n 2m 2m 1)
VA_5 A_5 0 PULSE(0 0 1m 100n 100n 2m 2m 1)
VA_6 A_6 0 PULSE(0 5 1m 100n 100n 2m 2m 1)
VA_7 A_7 0 PULSE(0 5 1m 100n 100n 2m 2m 1)
VB_4 B_4 0 PULSE(0 5 1m 100n 100n 2m 2m 1)
VB_5 B_5 0 PULSE(0 5 1m 100n 100n 2m 2m 1)
VB_6 B_6 0 PULSE(0 0 1m 100n 100n 2m 2m 1)
VB_7 B_7 0 PULSE(0 0 1m 100n 100n 2m 2m 1)
.backanno
.end